# Altium schematic sheet Модуль STM32F103RBT6_2.SchDoc: Что-то
size 420 x 297 mm; ApprovedBy: Человек; CheckedBy: Человек; Author: Человек; DrawnBy: Человек; DocumentNumber: АЕСН.ХХХХХХ.ХХХЭ3; SheetNumber: x; SheetTotal: x; DocumentName: Sheet1.SCHDOC
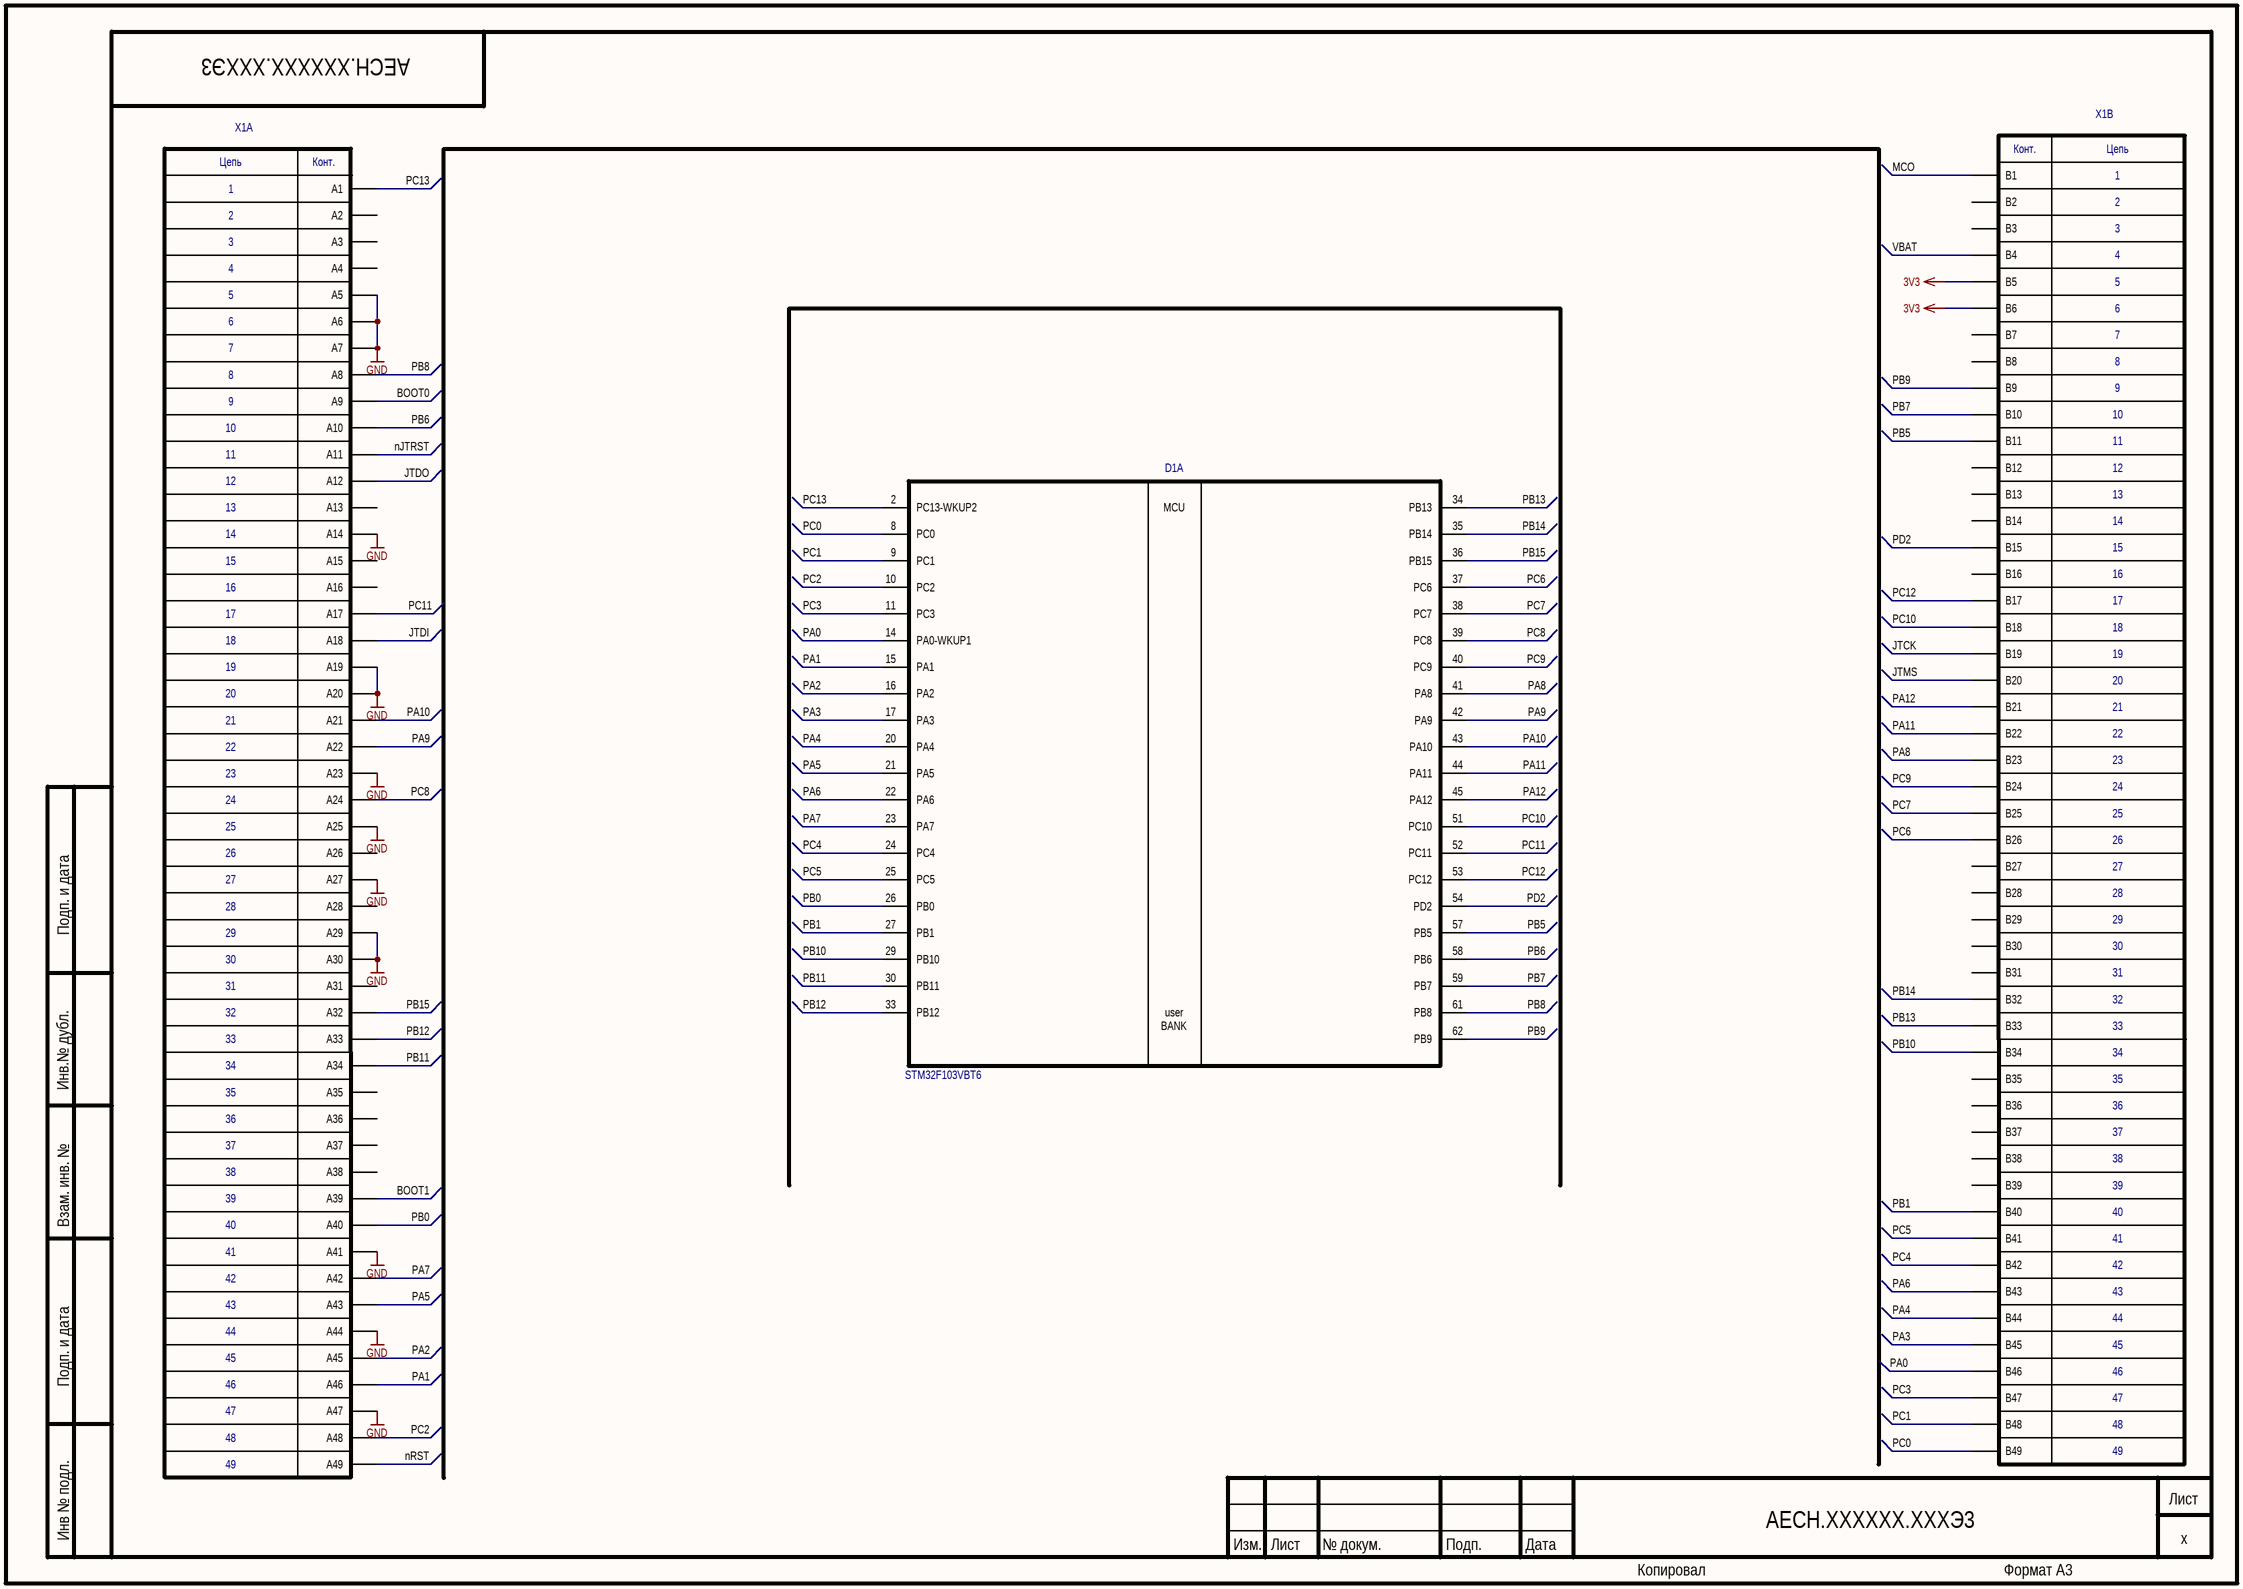
[diagram p0: Модуль STM32F103RBT6_2.SchDoc]

## Parts
D1  value STM32F103VBT6  [QFP50P1200X1200X160-64N]  (part A of 2)
X1  KONT_POLE_MEZ  [3113-112t_otv]  (value not drawn)  (parts A,B of 2)

## Nets
3V3: X1.B5 X1.B6
GND: X1.A5 X1.A6 X1.A7 X1.A14 X1.A19 X1.A20 X1.A23 X1.A25 X1.A27 X1.A29 X1.A30 X1.A41 X1.A44 X1.A47
BOOT0: X1.A9
BOOT1: X1.A39
JTCK: X1.B19
JTDI: X1.A18
JTDO: X1.A12
JTMS: X1.B20
MCO: X1.B1
nJTRST: X1.A11
nRST: X1.A49
PA0: D1.14(PA0-WKUP1) X1.B46
PA1: D1.15(PA1) X1.A46
PA2: D1.16(PA2) X1.A45
PA3: D1.17(PA3) X1.B45
PA4: D1.20(PA4) X1.B44
PA5: D1.21(PA5) X1.A43
PA6: D1.22(PA6) X1.B43
PA7: D1.23(PA7) X1.A42
PA8: D1.41(PA8) X1.B23
PA9: D1.42(PA9) X1.A22
PA10: D1.43(PA10) X1.A21
PA11: D1.44(PA11) X1.B22
PA12: D1.45(PA12) X1.B21
PB0: D1.26(PB0) X1.A40
PB1: D1.27(PB1) X1.B40
PB5: D1.57(PB5) X1.B11
PB6: D1.58(PB6) X1.A10
PB7: D1.59(PB7) X1.B10
PB8: D1.61(PB8) X1.A8
PB9: D1.62(PB9) X1.B9
PB10: D1.29(PB10) X1.B34
PB11: D1.30(PB11) X1.A34
PB12: D1.33(PB12) X1.A33
PB13: D1.34(PB13) X1.B33
PB14: D1.35(PB14) X1.B32
PB15: D1.36(PB15) X1.A32
PC0: D1.8(PC0) X1.B49
PC1: D1.9(PC1) X1.B48
PC2: D1.10(PC2) X1.A48
PC3: D1.11(PC3) X1.B47
PC4: D1.24(PC4) X1.B42
PC5: D1.25(PC5) X1.B41
PC6: D1.37(PC6) X1.B26
PC7: D1.38(PC7) X1.B25
PC8: D1.39(PC8) X1.A24
PC9: D1.40(PC9) X1.B24
PC10: D1.51(PC10) X1.B18
PC11: D1.52(PC11) X1.A17
PC12: D1.53(PC12) X1.B17
PC13: D1.2(PC13-WKUP2) X1.A1
PD2: D1.54(PD2) X1.B15
VBAT: X1.B4

Not connected (* = marked no-connect by the designer): X1 A2 A3 A4 A13 A15 A16 A26 A28 A31 A35 A36 A37 A38 B2 B3 B7 B8 B12 B13 B14 B16 B27 B28 B29 B30 B31 B35 B36 B37 B38 B39

## Notes on the sheet
- Подп. и дата
- Инв.№ дубл.
- Взам. инв. №
- Инв № подл.
- Изм.
- Лист
- № докум.
- Подп.
- Дата
- Копировал
- Формат А3
- (in symbol 3113-112T, part A) Цепь; Конт.; 1; 2; 3; 4; 5; 6; 7; 8; 9; 10; 11; 12; 13; 14; 15; 16; 17; 18; 19; 20; 21; 22; 23; 24; 25; 26; 27; 28; 29; 30; 31; 32; 33; 34; 35; 36; 37; 38; 39; 40; 41; 42; 43; 44; 45; 46; 47; 48; 49
- (in symbol 3113-112T, part B) Конт.; Цепь; 1; 2; 3; 4; 5; 6; 7; 8; 9; 10; 11; 12; 13; 14; 15; 16; 17; 18; 19; 20; 21; 22; 23; 24; 25; 26; 27; 28; 29; 30; 31; 32; 33; 34; 35; 36; 37; 38; 39; 40; 41; 42; 43; 44; 45; 46; 47; 48; 49
- (in symbol STM32F103RBT6, part A) MCU; user; BANK

## Library data of the parts
D1 = STM32F103RBT6: Company: Xilinx; PurtNamber: XC6SLX25-2FGG484C; Package: LQFP-48
X1 = 3113-112T